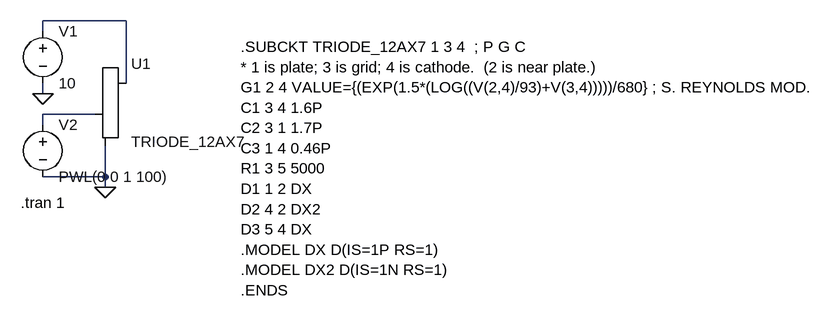
[diagram p0: schematic Draft3.asc]
Draft3.asc, the LTspice schematic file:
Version 4
SHEET 1 1176 680
WIRE 32 16 -96 16
WIRE -96 32 -96 16
WIRE 32 112 32 16
WIRE -96 128 -96 112
WIRE -16 160 -96 160
WIRE -96 176 -96 160
WIRE 0 256 0 208
WIRE 0 256 -96 256
WIRE 0 272 0 256
FLAG 0 272 0
FLAG -96 128 0
SYMBOL voltage -96 16 R0
WINDOW 123 0 0 Left 0
WINDOW 39 0 0 Left 0
SYMATTR InstName V1
SYMATTR Value 10
SYMBOL voltage -96 160 R0
WINDOW 123 0 0 Left 0
WINDOW 39 0 0 Left 0
SYMATTR InstName V2
SYMATTR Value PWL(0 0 1 100)
SYMBOL Misc\\triode 32 160 R0
SYMATTR InstName U1
SYMATTR Value TRIODE_12AX7
TEXT -130 296 Left 2 !.tran 1
TEXT 208 56 Left 2 !.SUBCKT TRIODE_12AX7 1 3 4  ; P G C\n* 1 is plate; 3 is grid; 4 is cathode.  (2 is near plate.)\nG1 2 4 VALUE={(EXP(1.5*(LOG((V(2,4)/93)+V(3,4)))))/680} ; S. REYNOLDS MOD.\nC1 3 4 1.6P\nC2 3 1 1.7P\nC3 1 4 0.46P\nR1 3 5 5000\nD1 1 2 DX\nD2 4 2 DX2\nD3 5 4 DX\n.MODEL DX D(IS=1P RS=1)\n.MODEL DX2 D(IS=1N RS=1)\n.ENDS

The netlist it stands for:
* Draft3.asc
V1 N001 0 10
V2 N002 0 PWL(0 0 1 100)
XU1 N001 N002 0 TRIODE_12AX7
.tran 1
.SUBCKT TRIODE_12AX7 1 3 4  ; P G C
* 1 is plate; 3 is grid; 4 is cathode.  (2 is near plate.)
G1 2 4 VALUE={(EXP(1.5*(LOG((V(2,4)/93)+V(3,4)))))/680} ; S. REYNOLDS MOD.
C1 3 4 1.6P
C2 3 1 1.7P
C3 1 4 0.46P
R1 3 5 5000
D1 1 2 DX
D2 4 2 DX2
D3 5 4 DX
.MODEL DX D(IS=1P RS=1)
.MODEL DX2 D(IS=1N RS=1)
.ENDS
.backanno
.end